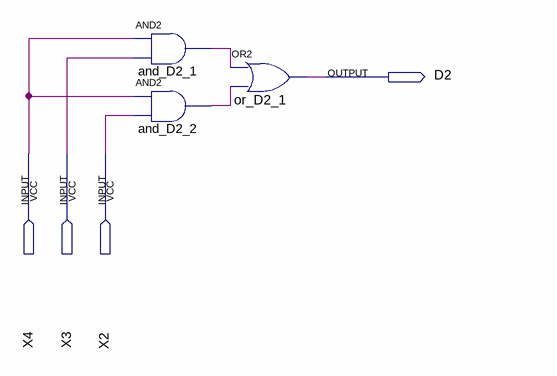
[diagram p0: schematic sheet]
// Quartus schematic conv_D2.bdf as structural Verilog: 3 symbols, 4 pins
module conv_D2 (
  input  X4,
  input  X3,
  input  X2,
  output D2
);

  wire and_D2_1_out, and_D2_2_out;

  and and_D2_1 (and_D2_1_out, X4, X3);
  and and_D2_2 (and_D2_2_out, X4, X2);
  or or_D2_1 (D2, and_D2_1_out, and_D2_2_out);
endmodule
